# EAGLE schematic axiom_beta_plugin_module_1xPMOD_v0.1.8f7400e7 (EAGLE 7.7.0)
Assembly variants: Beta
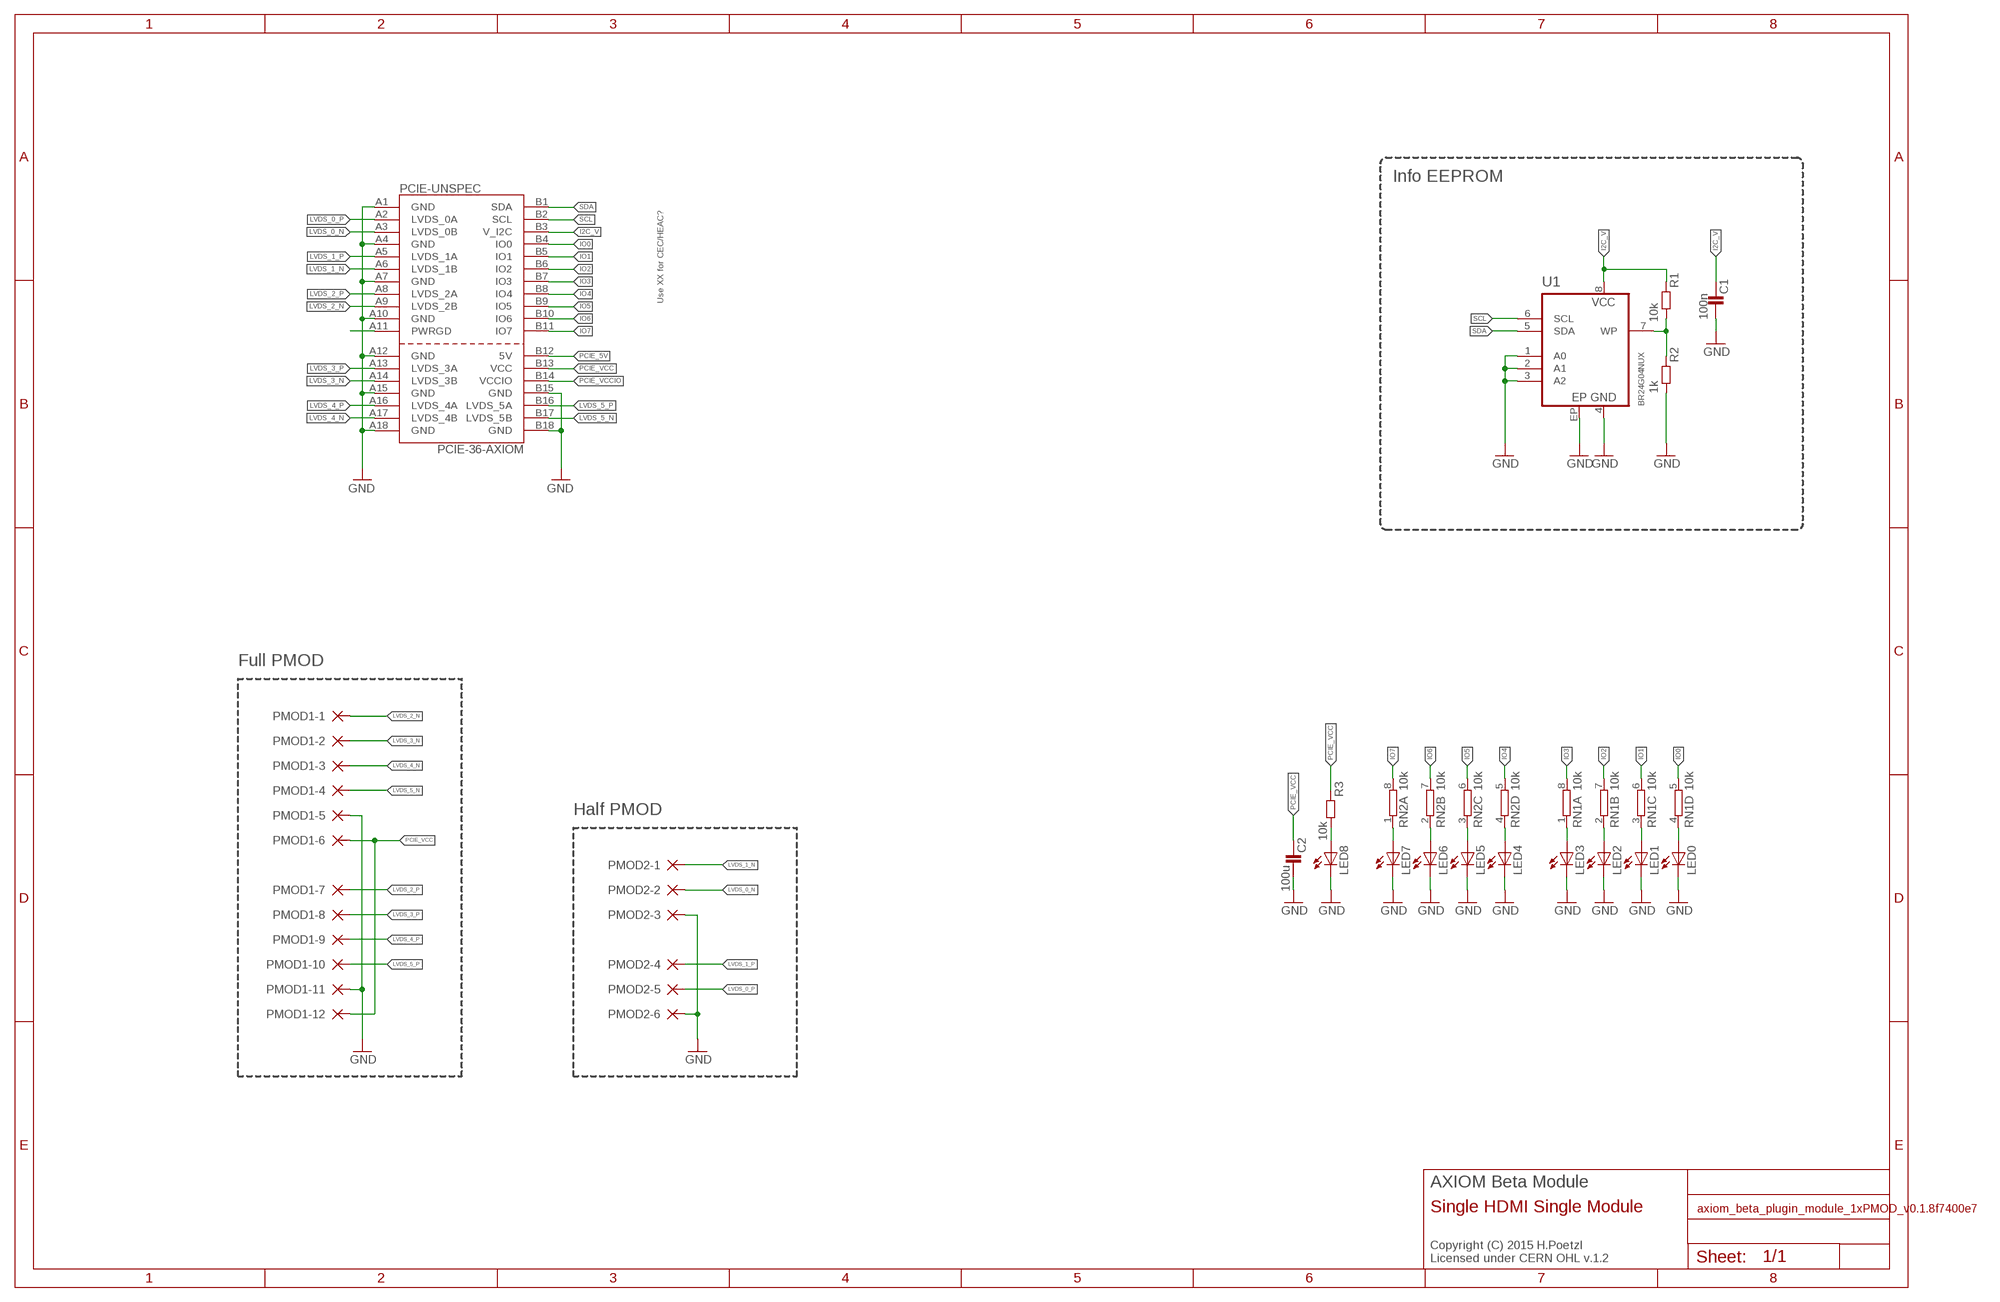
[diagram p0: schematic, sheet 1]

## Parts
C1  100n  C0402-B  [0402-B]
C2  100u  C1206-A  [1206-A]
LED0  LEDCHIPLED_0603  [CHIPLED_0603]
LED1  LEDCHIPLED_0603  [CHIPLED_0603]
LED2  LEDCHIPLED_0603  [CHIPLED_0603]
LED3  LEDCHIPLED_0603  [CHIPLED_0603]
LED4  LEDCHIPLED_0603  [CHIPLED_0603]
LED5  LEDCHIPLED_0603  [CHIPLED_0603]
LED6  LEDCHIPLED_0603  [CHIPLED_0603]
LED7  LEDCHIPLED_0603  [CHIPLED_0603]
LED8  LEDCHIPLED_0603  [CHIPLED_0603]
PCIE-UNSPEC  PCIE-36-AXIOM  [PCIE-36-AXIOM]  (not fitted in variant Beta)
PMOD1-1  SMD-PAD1.6X3.8MM-U  [1.6X3.8U-MM]  (not fitted in variant Beta)
PMOD1-2  SMD-PAD1.6X3.8MM-U  [1.6X3.8U-MM]  (not fitted in variant Beta)
PMOD1-3  SMD-PAD1.6X3.8MM-U  [1.6X3.8U-MM]  (not fitted in variant Beta)
PMOD1-4  SMD-PAD1.6X3.8MM-U  [1.6X3.8U-MM]  (not fitted in variant Beta)
PMOD1-5  SMD-PAD1.6X3.8MM-U  [1.6X3.8U-MM]  (not fitted in variant Beta)
PMOD1-6  SMD-PAD1.6X3.8MM-U  [1.6X3.8U-MM]  (not fitted in variant Beta)
PMOD1-7  SMD-PAD1.6X3.8MM-U  [1.6X3.8U-MM]  (not fitted in variant Beta)
PMOD1-8  SMD-PAD1.6X3.8MM-U  [1.6X3.8U-MM]  (not fitted in variant Beta)
PMOD1-9  SMD-PAD1.6X3.8MM-U  [1.6X3.8U-MM]  (not fitted in variant Beta)
PMOD1-10  SMD-PAD1.6X3.8MM-U  [1.6X3.8U-MM]  (not fitted in variant Beta)
PMOD1-11  SMD-PAD1.6X3.8MM-U  [1.6X3.8U-MM]  (not fitted in variant Beta)
PMOD1-12  SMD-PAD1.6X3.8MM-U  [1.6X3.8U-MM]  (not fitted in variant Beta)
PMOD2-1  SMD-PAD1.6X3.8MM-U  [1.6X3.8U-MM]  (not fitted in variant Beta)
PMOD2-2  SMD-PAD1.6X3.8MM-U  [1.6X3.8U-MM]  (not fitted in variant Beta)
PMOD2-3  SMD-PAD1.6X3.8MM-U  [1.6X3.8U-MM]  (not fitted in variant Beta)
PMOD2-4  SMD-PAD1.6X3.8MM-U  [1.6X3.8U-MM]  (not fitted in variant Beta)
PMOD2-5  SMD-PAD1.6X3.8MM-U  [1.6X3.8U-MM]  (not fitted in variant Beta)
PMOD2-6  SMD-PAD1.6X3.8MM-U  [1.6X3.8U-MM]  (not fitted in variant Beta)
R1  10k  R0402-B  [0402-B]
R2  1k  R0402-B  [0402-B]
R3  10k  R0402-B  [0402-B]
RN1  10k  4R-NCAY16  [CAY16]
RN2  10k  4R-NCAY16  [CAY16]
U1  BR24G04NUX  [DFN200X300X100-9N]

## Nets
GND: C1.2 C2.2 LED0.C LED1.C LED2.C LED3.C LED4.C LED5.C LED6.C LED7.C LED8.C PCIE-UNSPEC.A1(GND) PCIE-UNSPEC.A4(GND) PCIE-UNSPEC.A7(GND) PCIE-UNSPEC.A10(GND) PCIE-UNSPEC.A12(GND) PCIE-UNSPEC.A15(GND) PCIE-UNSPEC.A18(GND) PCIE-UNSPEC.B15(GND) PCIE-UNSPEC.B18(GND) PMOD1-5.1(P) PMOD1-11.1(P) PMOD2-3.1(P) PMOD2-6.1(P) R2.2 U1.1(A0) U1.2(A1) U1.3(A2) U1.4(GND) U1.EP
I2C_V: C1.1 PCIE-UNSPEC.B3(V_I2C) R1.1 U1.8(VCC)
IO0: PCIE-UNSPEC.B4(IO0) RN1.5
IO1: PCIE-UNSPEC.B5(IO1) RN1.6
IO2: PCIE-UNSPEC.B6(IO2) RN1.7
IO3: PCIE-UNSPEC.B7(IO3) RN1.8
IO4: PCIE-UNSPEC.B8(IO4) RN2.5
IO5: PCIE-UNSPEC.B9(IO5) RN2.6
IO6: PCIE-UNSPEC.B10(IO6) RN2.7
IO7: PCIE-UNSPEC.B11(IO7) RN2.8
LVDS_0_N: PCIE-UNSPEC.A3(LVDS_0B) PMOD2-2.1(P)
LVDS_0_P: PCIE-UNSPEC.A2(LVDS_0A) PMOD2-5.1(P)
LVDS_1_N [LVDS]: PCIE-UNSPEC.A6(LVDS_1B) PMOD2-1.1(P)
LVDS_1_P [LVDS]: PCIE-UNSPEC.A5(LVDS_1A) PMOD2-4.1(P)
LVDS_2_N [LVDS]: PCIE-UNSPEC.A9(LVDS_2B) PMOD1-1.1(P)
LVDS_2_P [LVDS]: PCIE-UNSPEC.A8(LVDS_2A) PMOD1-7.1(P)
LVDS_3_N [LVDS]: PCIE-UNSPEC.A14(LVDS_3B) PMOD1-2.1(P)
LVDS_3_P [LVDS]: PCIE-UNSPEC.A13(LVDS_3A) PMOD1-8.1(P)
LVDS_4_N [LVDS]: PCIE-UNSPEC.A17(LVDS_4B) PMOD1-3.1(P)
LVDS_4_P [LVDS]: PCIE-UNSPEC.A16(LVDS_4A) PMOD1-9.1(P)
LVDS_5_N: PCIE-UNSPEC.B17(LVDS_5B) PMOD1-4.1(P)
LVDS_5_P: PCIE-UNSPEC.B16(LVDS_5A) PMOD1-10.1(P)
N$12: R1.2 R2.1 U1.7(WP)
N$196: LED3.A RN1.1
N$197: LED2.A RN1.2
N$198: LED1.A RN1.3
N$202: LED0.A RN1.4
N$209: PCIE-UNSPEC.A11(PWRGD)
N$211: LED8.A R3.2
N$275: LED7.A RN2.1
N$276: LED6.A RN2.2
N$277: LED5.A RN2.3
N$278: LED4.A RN2.4
PCIE_5V: PCIE-UNSPEC.B12(5V)
PCIE_VCC: C2.1 PCIE-UNSPEC.B13(VCC) PMOD1-6.1(P) PMOD1-12.1(P) R3.1
PCIE_VCCIO: PCIE-UNSPEC.B14(VCCIO)
SCL: PCIE-UNSPEC.B2(SCL) U1.6(SCL)
SDA: PCIE-UNSPEC.B1(SDA) U1.5(SDA)

## Notes on the sheet
- Info EEPROM
- Use XX for CEC/HEAC?
- Full PMOD
- Half PMOD
- AXIOM Beta Module
- Single HDMI Single Module
- Copyright (C) 2015 H.Poetzl
  Licensed under CERN OHL v.1.2

## Library data of the parts
C1 C2 = generic-rcl:C
LED0 LED1-LED8 = led:LED: LED OSRAM: - CHIPLED LG R971, LG N971, LY N971, LG Q971, LY Q971, LO R971, LY R971 LH N974, LH R974 LS Q976, LO Q976, LY Q976 LO Q996 - Hyper CHIPLED LW Q18S LB Q993, LB Q99A, LB R99A - SideLED LS A670, LO A670, LY A670, LG A670, LP A670 LB A673, LV A673, LT A673, LW A673 LH A674 LY A675 LS A676, LA A676, LO A676, LY A676, LW A676 LS A679, LY A679, LG A679 - Hyper Micro SIDELED® LS Y876, LA Y876, LO Y876, LY Y876 LT Y87S - SmartLED LW L88C, LW L88S LB L89C, LB L89S, LG L890 LS L89K, LO L89K, LY L89K LS L896, LA L896, LO L896, LY L896 - TOPLED LS T670, LO T670, LY T670, LG T670, LP T670 LSG T670, LSP T670, LSY T670, LOP T670, LYG T670 LG T671, LOG T671, LSG T671 LB T673, LV T673, LT T673, LW T673 LH T674 LS T676, LA T676, LO T676, LY T676, LB T676, LH T676, LSB T676, LW T676 LB T67C, LV T67C, LT T67C, LS T67K, LO T67K, LY T67K, LW E67C LS E67B, LA E67B, LO E67B, LY E67B, LB E67C, LV E67C, LT E67C LW T67C LS T679, LY T679, LG T679 LS T770, LO T770, LY T770, LG T770, LP T770 LB T773, LV T773, LT T773, LW T773 LH T774 LS E675, LA E675, LY E675, LS T675 LS T776, LA T776, LO T776, LY T776, LB T776 LHGB T686 LT T68C, LB T68C - Hyper Mini TOPLED® LB M676 - Mini TOPLED Santana® LG M470 LS M47K, LO M47K, LY M47K Source: http://www.osram.convergy.de LUXEON: - LUMILED® LXK2-PW12-R00, LXK2-PW12-S00, LXK2-PW14-U00, LXK2-PW14-V00 LXK2-PM12-R00, LXK2-PM12-S00, LXK2-PM14-U00 LXK2-PE12-Q00, LXK2-PE12-R00, LXK2-PE12-S00, LXK2-PE14-T00, LXK2-PE14-U00 LXK2-PB12-K00, LXK2-PB12-L00, LXK2-PB12-M00, LXK2-PB14-N00, LXK2-PB14-P00, LXK2-PB14-Q00 LXK2-PR12-L00, LXK2-PR12-M00, LXK2-PR14-Q00, LXK2-PR14-R00 LXK2-PD12-Q00, LXK2-PD12-R00, LXK2-PD12-S00 LXK2-PH12-R00, LXK2-PH12-S00 LXK2-PL12-P00, LXK2-PL12-Q00, LXK2-PL12-R00 Source: www.luxeon.com KINGBRIGHT: KA-3528ASYC Source: www.kingbright.com
PCIE-UNSPEC = PCIe:PCIE-36-AXIOM
PMOD1-1-PMOD1-12 PMOD2-1-PMOD2-6 = smd_pads:SMD-PAD: SMD PAD
R1-R3 = generic-rcl:R
RN1 RN2 = resistor-dil:4R-N: Array Chip Resistor Source: RS Component / Phycomp; OC_FARNELL: unknown; OC_NEWARK: unknown
U1 = eeprom:BR24G04

## Net classes
0 default: width 0.152 mm, drill 0.203 mm
1 LVDS: width 0.152 mm, drill 0.254 mm, clearance 0.152 mm